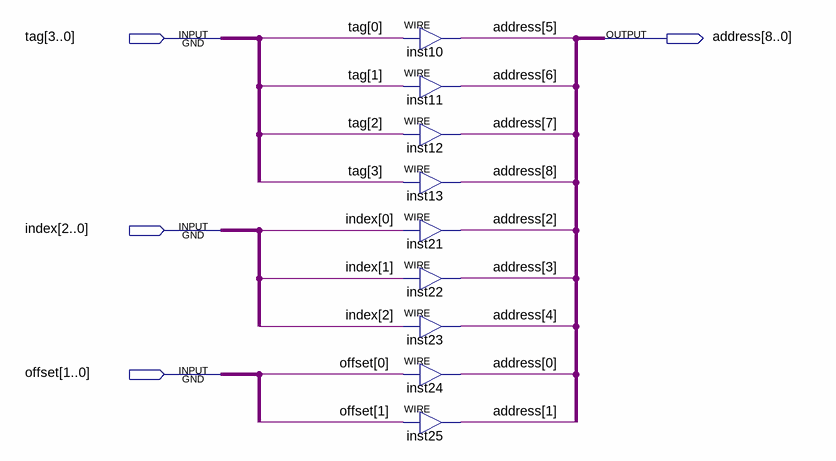
[diagram p0: schematic sheet]
// Quartus schematic address_combiner.bdf as structural Verilog: 9 symbols, 4 pins
module address_combiner (
  input  [3:0] tag,
  input  [2:0] index,
  input  [1:0] offset,
  output [8:0] address
);

  assign address[5] = tag[0];  // WIRE inst10
  assign address[6] = tag[1];  // WIRE inst11
  assign address[7] = tag[2];  // WIRE inst12
  assign address[8] = tag[3];  // WIRE inst13
  assign address[2] = index[0];  // WIRE inst21
  assign address[3] = index[1];  // WIRE inst22
  assign address[4] = index[2];  // WIRE inst23
  assign address[0] = offset[0];  // WIRE inst24
  assign address[1] = offset[1];  // WIRE inst25
endmodule
